# Altium schematic sheet 01 ESP32 MAIN_A.SchDoc
size 420 x 297 mm
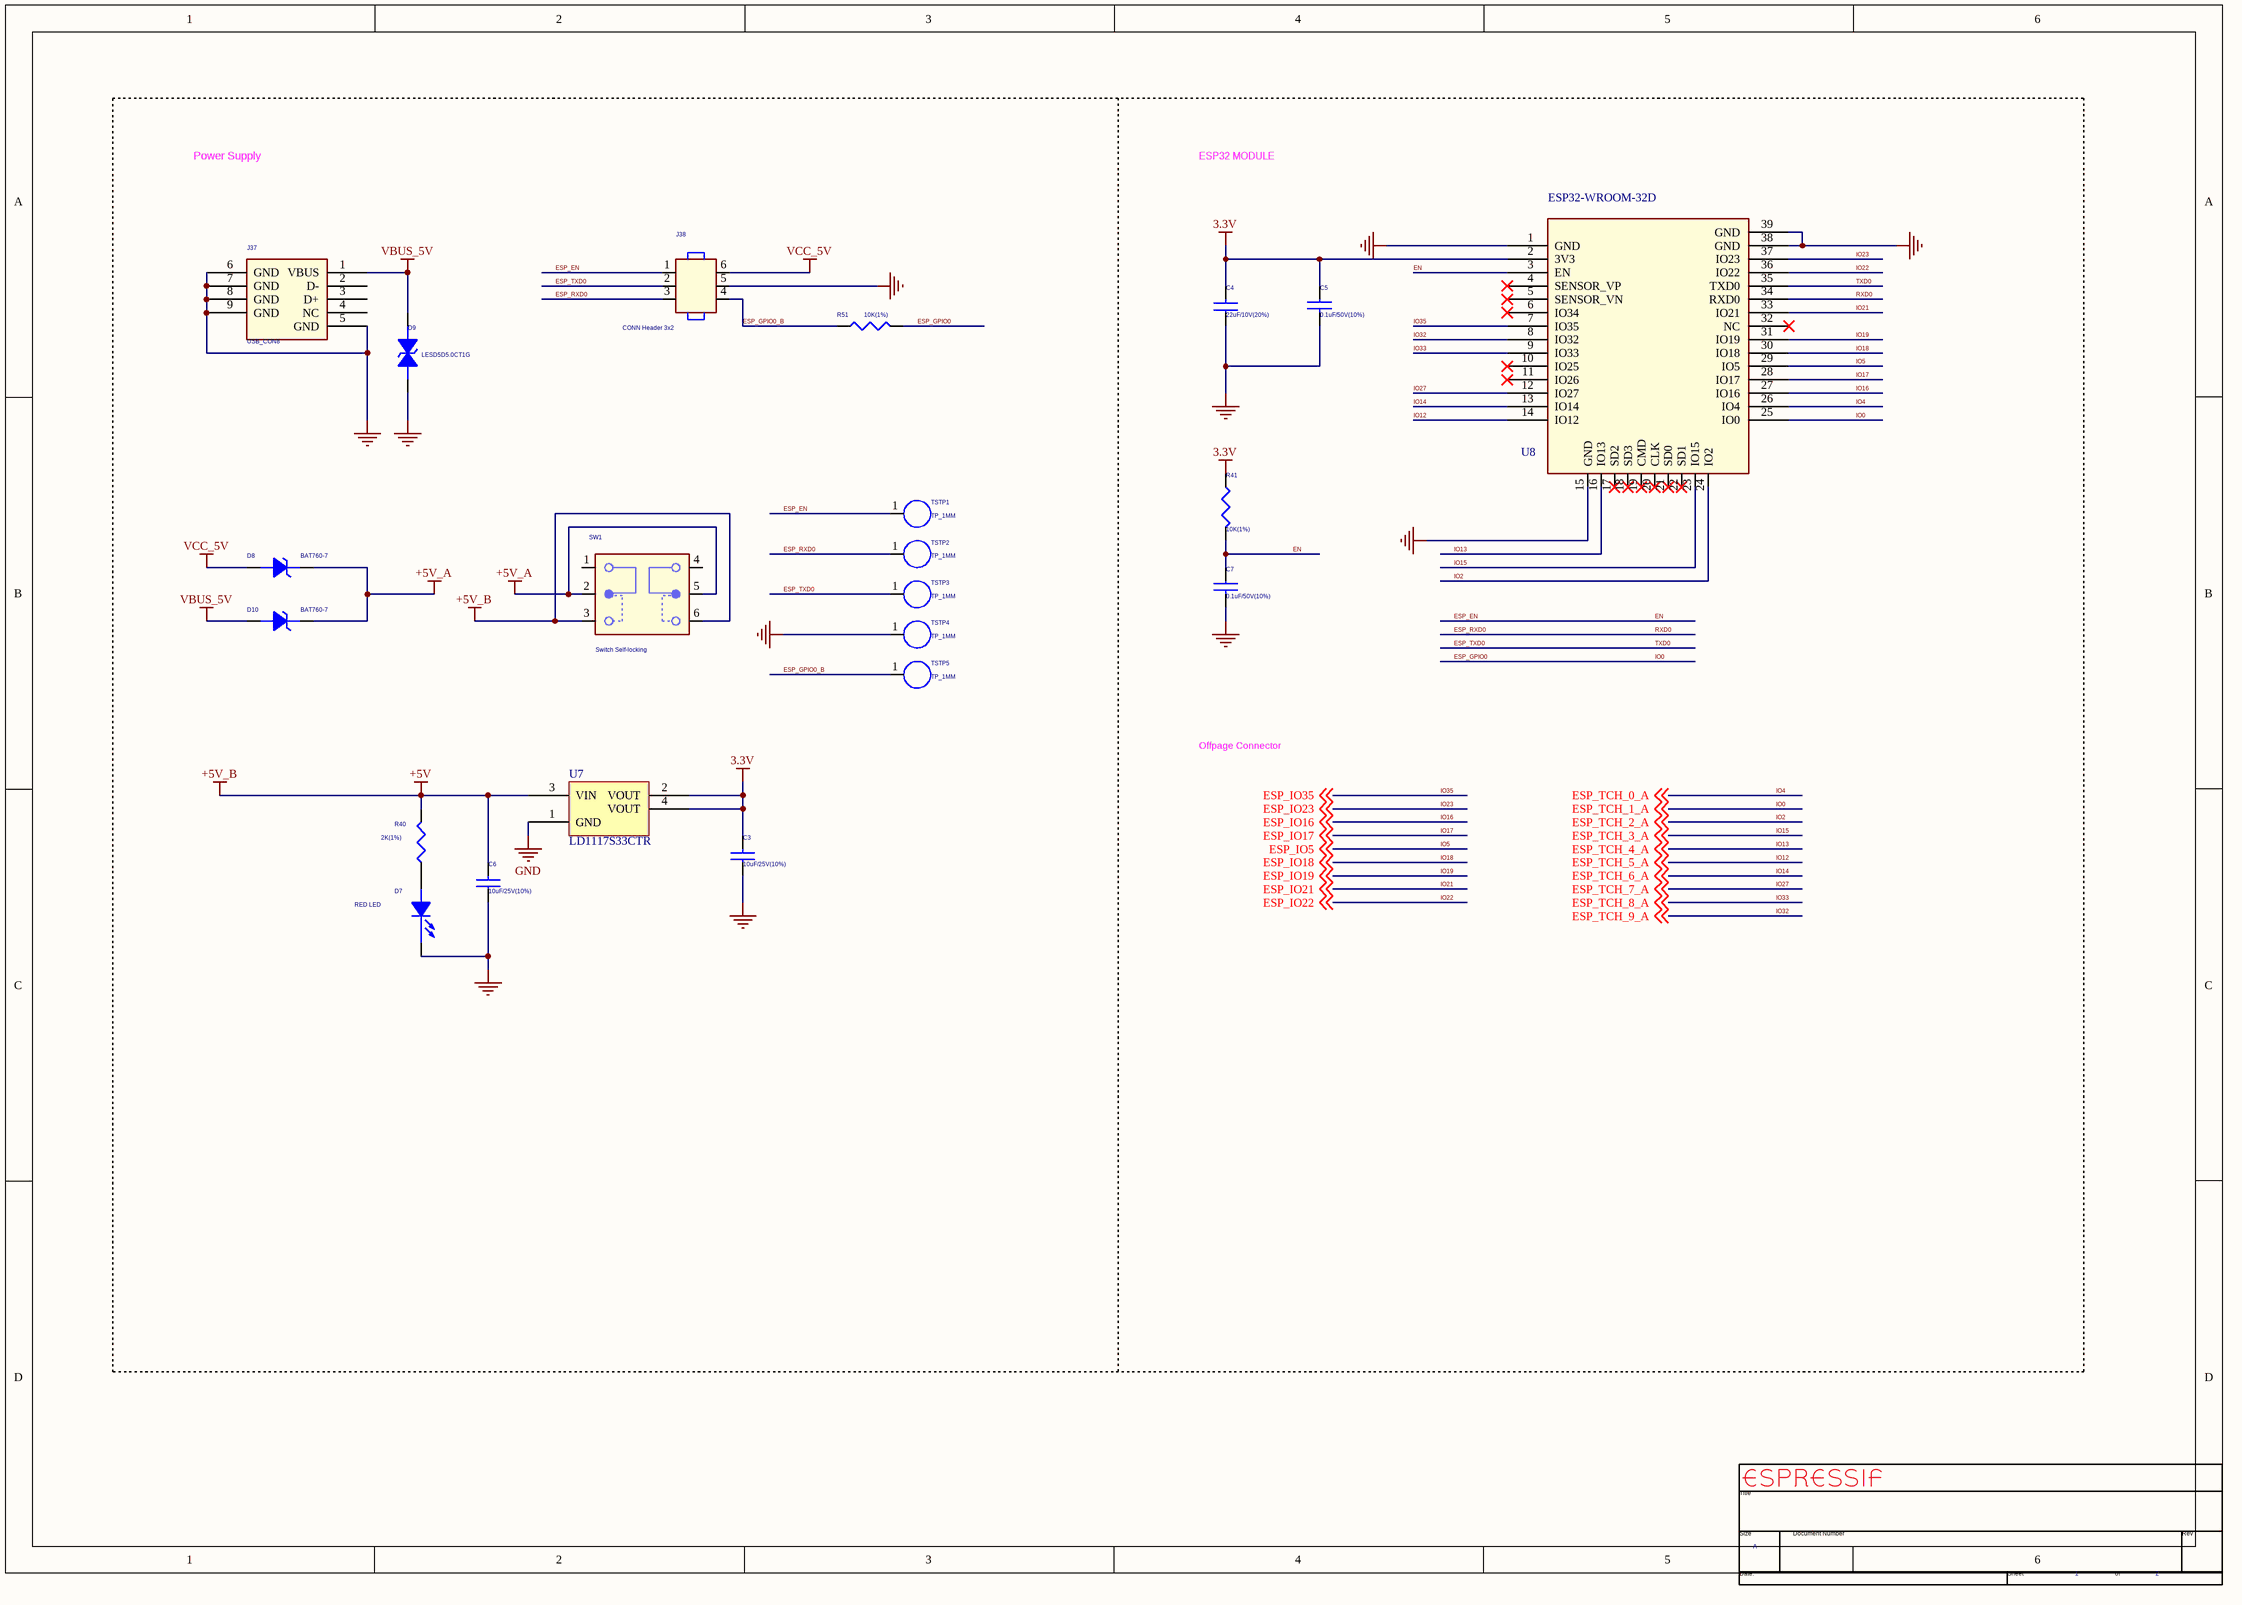
[diagram p0: 01 ESP32 MAIN_A.SchDoc]

## Parts
*  Page Size: A  Page Number: 1  Page Count: 2  (hidden comment: espTitleBlock1)  (graphical)
C3  10uF/25V(10%)  [0603C]
C4  22uF/10V(20%)  [C0603]
C5  0.1uF/50V(10%)  [C0402]
C6  10uF/25V(10%)  [0603C]
C7  0.1uF/50V(10%)  [C0402]
D7  RED LED  [0603D/A]
D8  BAT760-7  [SOD-323]
D9  LESD5D5.0CT1G  [ESD0402]
D10  BAT760-7  [SOD-323]
J37  USB_CON8  [USB_5P]
J38  CONN Header 3x2  [DC3-6P-1P27]
R40  2K(1%)  [0402R]
R41  10K(1%)  [0402R]
R51  10K(1%)  [0402R]
SW1  Switch Self-locking  [SW5858-6]
TSTP1  TP_1MM  [TP_1MM]
TSTP2  TP_1MM  [TP_1MM]
TSTP3  TP_1MM  [TP_1MM]
TSTP4  TP_1MM  [TP_1MM]
TSTP5  TP_1MM  [TP_1MM]
U7  LD1117S33CTR  [ST SOT-223]
U8  ESP32-WROOM-32D  [*MODULE_ESP32-WROOM-32D]

## Nets
3.3V: C3.2 C4.2 C5.1 R41.1 U7.2(VOUT) U7.4(VOUT) U8.2(3V3)
+5V: C6.2 R40.1 SW1.3(NO1) SW1.6(NO2) U7.3(VIN)  [also labelled +5V_B]
+5V_A: D8.1 D10.1 SW1.2(COM1) SW1.5(COM2)
GND: C3.1 C4.1 C5.2 C6.1 C7.2 D7.2(CATHODE) D9.2 J37.5(GND) J37.6(GND) J37.7(GND) J37.8(GND) J37.9(GND) J38.5 TSTP4.1 U7.1(GND) U8.1(GND) U8.15(GND) U8.38(GND) U8.39(GND)
VBUS_5V: D9.1 D10.2 J37.1(VBUS)
VCC_5V: D8.2 J38.6
EN: C7.1 J38.1 R41.2 TSTP1.1 U8.3(EN)  [also labelled ESP_EN]
ESP_GPIO0: R51.2 U8.25(IO0) ; off-sheet ESP_TCH_1_A  [also labelled ESP_TCH_1_A, IO0]
ESP_GPIO0_B: J38.4 R51.1 TSTP5.1
ESP_RXD0: J38.3 TSTP2.1 U8.34(RXD0)  [also labelled RXD0]
ESP_TXD0: J38.2 TSTP3.1 U8.35(TXD0)  [also labelled TXD0]
IO2: U8.24(IO2) ; off-sheet ESP_TCH_2_A  [also labelled ESP_TCH_2_A]
IO4: U8.26(IO4) ; off-sheet ESP_TCH_0_A  [also labelled ESP_TCH_0_A]
IO5: U8.29(IO5) ; off-sheet ESP_IO5  [also labelled ESP_IO5]
IO12: U8.14(IO12) ; off-sheet ESP_TCH_5_A  [also labelled ESP_TCH_5_A]
IO13: U8.16(IO13) ; off-sheet ESP_TCH_4_A  [also labelled ESP_TCH_4_A]
IO14: U8.13(IO14) ; off-sheet ESP_TCH_6_A  [also labelled ESP_TCH_6_A]
IO15: U8.23(IO15) ; off-sheet ESP_TCH_3_A  [also labelled ESP_TCH_3_A]
IO16: U8.27(IO16) ; off-sheet ESP_IO16  [also labelled ESP_IO16]
IO17: U8.28(IO17) ; off-sheet ESP_IO17  [also labelled ESP_IO17]
IO18: U8.30(IO18) ; off-sheet ESP_IO18  [also labelled ESP_IO18]
IO19: U8.31(IO19) ; off-sheet ESP_IO19  [also labelled ESP_IO19]
IO21: U8.33(IO21) ; off-sheet ESP_IO21  [also labelled ESP_IO21]
IO22: U8.36(IO22) ; off-sheet ESP_IO22  [also labelled ESP_IO22]
IO23: U8.37(IO23) ; off-sheet ESP_IO23  [also labelled ESP_IO23]
IO27: U8.12(IO27) ; off-sheet ESP_TCH_7_A  [also labelled ESP_TCH_7_A]
IO32: U8.8(IO32) ; off-sheet ESP_TCH_9_A  [also labelled ESP_TCH_9_A]
IO33: U8.9(IO33) ; off-sheet ESP_TCH_8_A  [also labelled ESP_TCH_8_A]
IO35: U8.7(IO35) ; off-sheet ESP_IO35  [also labelled ESP_IO35]
NetD7_1: D7.1(ANODE) R40.2

Not connected (* = marked no-connect by the designer): J37 2(D-) 3(D+) 4(NC); SW1 1(NC1) 4(NC2); U8 4(SENSOR_VP)* 5(SENSOR_VN)* 6(IO34)* 10(IO25)* 11(IO26)* 17(SD2)* 18(SD3)* 19(CMD)* 20(CLK)* 21(SD0)* 22(SD1)* 32(NC)*

## Notes on the sheet
- Power Supply
- ESP32 MODULE
- Offpage Connector
- (in symbol espTitleBlock1) Title; Size; Document Number; Rev; Date:; Sheet; of

## Library data of the parts
C3-C7 = CAP NP
D7 = LED_1
D8 D10 = DIODE_POWER
D9 = DIODE BI-DIR TRIG
J37 = CON4_2
J38 = 12 HEADER_9
R40 R41 R51 = RESISTOR_0
SW1 = Switch_selflocking_6p
TSTP1-TSTP5 = CON1_0
U7 = LD1117S33CTR: IC REG LDO 3.3V 0.8A SOT223; Manufacturer: STMicroelectronics; Topology: Positive Fixed; Voltage Dropout: 1.1V @ 800mA; Voltage - Input: Up to 15V; Part Number: LD1117S33CTR; PartId: 7963; Supplier 1: Digi-Key; Supplier Part Number 1: 497-1241-2-ND; ComponentLink1Description: Datasheet; ComponentLink1URL: http://www.st.com/web/en/resource/technical/document/datasheet/CD00000544.pdf; ComponentLink2Description: Digi-Key Listing; ComponentLink2URL: http://www.digikey.com/product-detail/en/LD1117S33CTR/497-1241-2-ND/585765; Price: 0.127; Device Package: TO-261-4, TO-261AA; Voltage - Output: 3.3V; Current - Limit (Min): -; Operating Temperature: -40C ~ 125C
U8 = ESP32-WROOM-32D: IC: SoC; GPIO, I2C, I2S, IR, SD, SDIO, SPI, UART; 2.7Ã·3.6VDC; 20dBm; MF: Espressif Systems; Package: Module Espressif Systems; Price: None; Availability: Unavailable; MP: ESP32-WROOM-32D; SnapEDA_Link: https://www.snapeda.com/parts/ESP32-WROOM-32D/Espressif%20Systems/view-part/?ref=snap; Value: *
* = espTitleBlock1: Page Create Date: March  8, 1995